# Altium project hava_kalitesi_olcumu.PrjPcb
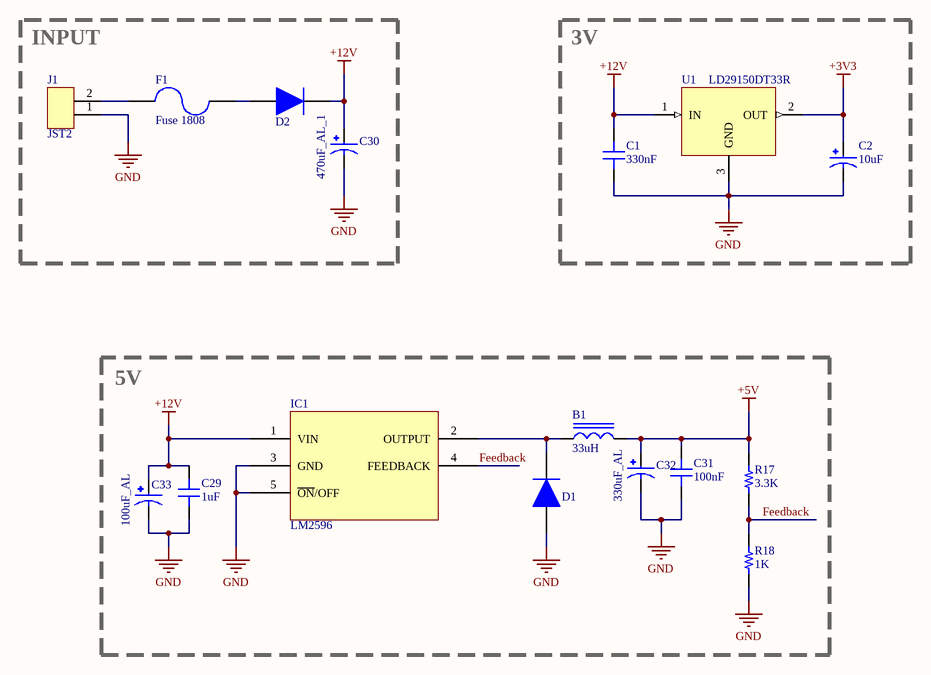
[diagram p0: Power.SchDoc]
4 sheets, 82 parts. Net scope: global (net labels, ports and power ports of the same name join across sheets).
Board file: hava_kalitesi_olcumu.PcbDoc
Sheets:
  Power.SchDoc
  Microcontroller.SchDoc
  GasSensor.SchDoc
  GSM.SchDoc

## Sheet Power.SchDoc
size A4

### Parts
B1  33uH  [DR125]
C1  330nF  [CAP 0603_1608]
C2  10uF  [TANTAL B-CASE]
C29  1uF  [CAP 0603_1608]
C30  470uF_AL_1  [10x12 Al Cap]
C31  100nF  [CAP 0603_1608]
C32  330uF_AL  [10x12 Al Cap]
C33  100uF_AL  [10x12 Al Cap]
D1  1N4148WS  [SOD323F]  (value not drawn)
D2  1N4148WS  [SOD323F]  (value not drawn)
F1  Fuse 1808  [1808]
IC1  LM2596  [D2PAK]
J1  JST2  [JST2]
R17  3.3K  [RES 0603_1608]
R18  1K  [RES 0603_1608]
U1  LD29150DT33R  [TO252-3 DPAK]

### Blocks framed on the sheet
INPUT: C30 D2 F1 J1
3V: C1 C2 U1
5V: B1 C29 C31-C33 D1 IC1 R17 R18

### Nets
+3V3: C2.+ U1.2(OUT)
+5V: B1.2 C31.2 C32.1(+) R17.2
+12V: C1.2 C29.2 C30.1(+) C33.1(+) D2.1 IC1.1(VIN) U1.1(IN)
GND: C1.1 C2.- C29.1 C30.2(-) C31.1 C32.2(-) C33.2(-) D1.2 IC1.3(GND) IC1.5(~{ON}/OFF) J1.1 R18.1 U1.3(GND)
Feedback: IC1.4(FEEDBACK) R17.1 R18.2
NetB1_1: B1.1 D1.1 IC1.2(OUTPUT)
NetD2_2: D2.2 F1.2
NetF1_1: F1.1 J1.2

### Library data of the parts
B1 = 33uH: DR125
C1 = 330nF: CERAMİC 1206 SMD
C2 = 10uF: TANTAL
C29 = 1uF: CERAMİC 1206 SMD
C30 = 470uF_AL_1: Aluminium Electrolytic Capacitors; ComponentLink1Description: Vishay; ComponentLink1URL: https://www.mouser.com.tr/datasheet/2/427/136rvi-1762300.pdf
C31 = 100nF: CERAMİC 1206 SMD
C32 = 330uF_AL: Aluminium Electrolytic Capacitors; ComponentLink1Description: Vİshay; ComponentLink1URL: https://www.mouser.com.tr/datasheet/2/427/136rvi-1762300.pdf
C33 = 100uF_AL: Aluminium Electrolytic Capacitors; ComponentLink1Description: Vishay; ComponentLink1URL: https://www.mouser.com.tr/datasheet/2/427/136rvi-1762300.pdf
D1 D2 = 1N4148WS: Diode, Single, 75 V, 150 mA, 1 V, 4 ns; Manufacturer: ON Semiconductor / Fairchild; Forward Current: 150mA; Reverse Recovery Time: 4ns; Max Repetitive Reverse Voltage (Vrrm): 75V; Power Dissipation: 200mW; Max Reverse Current: 5uA; Forward Voltage: 1V; Max Forward Surge Current (Ifsm): 2A; Supplier 1: Digi-Key; Manufacturer Part Number: 1N4148WS; RoHS: Yes; Category: Rectifier Diodes; Stock 1: 79118; Pricing 1: 1=0,17000, 10=0,12100, 100=0,06530, 500=0,05128, 1000=0,03562 (USD); Mount: Surface Mount; Number of Pins: 2; Contact Plating: Tin,Matte; Weight: 0.0276g; Min Operating Temperature: -55°C; Max Operating Temperature: 150°C; Packaging: Tape and Reel; Package Quantity: 1; Recovery Time: 4ns; Average Rectified Current: 150mA; Element Configuration: Single; Reverse Voltage: 75V; Max Reverse Voltage (DC): 75V; Series: -; Length: 1.8mm; Width: 1.35mm; Height: 1mm; Radiation Hardening: No; REACH SVHC: No SVHC; Lead Free: Lead Free; RoHS Compliant: Yes; ComponentLink1URL: https://datasheet.ciiva.com/25968/1n914bws-25968945.pdf?src-supplier=Avnet+Europe; ComponentLink1Description: https://datasheet.ciiva.com/25968/1n914bws-25968945.pdf?src-supplier=Avnet+Europe; ComponentLink2URL: https://datasheet.ciiva.com/30479/0900766b810e1cd3-30479206.pdf?src-supplier=RSComponents; ComponentLink2Description: https://datasheet.ciiva.com/30479/0900766b810e1cd3-30479206.pdf?src-supplier=RSComponents; ComponentLink3URL: https://datasheet.ciiva.com/910/1n4148ws-910381.pdf?src-supplier=Digi-Key; ComponentLink3Description: https://datasheet.ciiva.com/910/1n4148ws-910381.pdf?src-supplier=Digi-Key; ComponentLink4URL: https://datasheet.ciiva.com/15208/getdatasheetpartid-127819-15208358.pdf?src-supplier=Verical; ComponentLink4Description: https://datasheet.ciiva.com/15208/getdatasheetpartid-127819-15208358.pdf?src-supplier=Verical; ComponentLink5URL: https://datasheet.ciiva.com/8300/1n914bws-8300360.pdf?src-supplier=Avnet; ComponentLink5Description: https://datasheet.ciiva.com/8300/1n914bws-8300360.pdf?src-supplier=Avnet; ComponentLink6URL: https://datasheet.ciiva.com/910/1n4148ws-910380.pdf?src-supplier=Digi-Key; ComponentLink6Description: https://datasheet.ciiva.com/910/1n4148ws-910380.pdf?src-supplier=Digi-Key; ComponentLink7URL: https://datasheet.ciiva.com/910/1n4148ws-910382.pdf?src-supplier=Digi-Key; ComponentLink7Description: https://datasheet.ciiva.com/910/1n4148ws-910382.pdf?src-supplier=Digi-Key; Supplier Part Number 1: 1N4148WSFSCT-ND
F1 = FUSE: FUSE BRD MNT 125VAC/VDC; ComponentLink1Description: Direnc.net; ComponentLink1URL: https://www.direnc.net/1a-smd-sigorta; ComponentLink2Description: Motorobit; ComponentLink2URL: https://www.motorobit.com/urun/1a-1808-kilif-smd-sigorta; ComponentLink3Description: Datasheet; ComponentLink3URL: https://www.littelfuse.com/~/media/electronics/datasheets/fuses/littelfuse_fuse_452_454_datasheet.pdf.pdf; ComponentLink4Description: Step; ComponentLink4URL: https://www.3dcontentcentral.com.tr/secure/download-model.aspx?catalogid=171&id=343808; ComponentLink5Description: Özdisan; ComponentLink5URL: https://www.ozdisan.com/devre-koruyucular/sigorta-bilesenleri/sigortalar/0454001-NR
IC1 = LM2596: Buck Converter
J1 = JST2: 2 PIN 2.54MM
R17 = 3.3K: SMT RES 1206
R18 = 1K: SMT RES 1206
U1 = LD29150: IC-29150 REG LDO 3V3 1.5A DPAK; ComponentLink1Description: Özdisan; ComponentLink1URL: https://ozdisan.com/entegre-devreler-ics/guc-entegreleri/lineer-voltaj-regulatorleri/LD29150DT33R

## Sheet Microcontroller.SchDoc
size A4
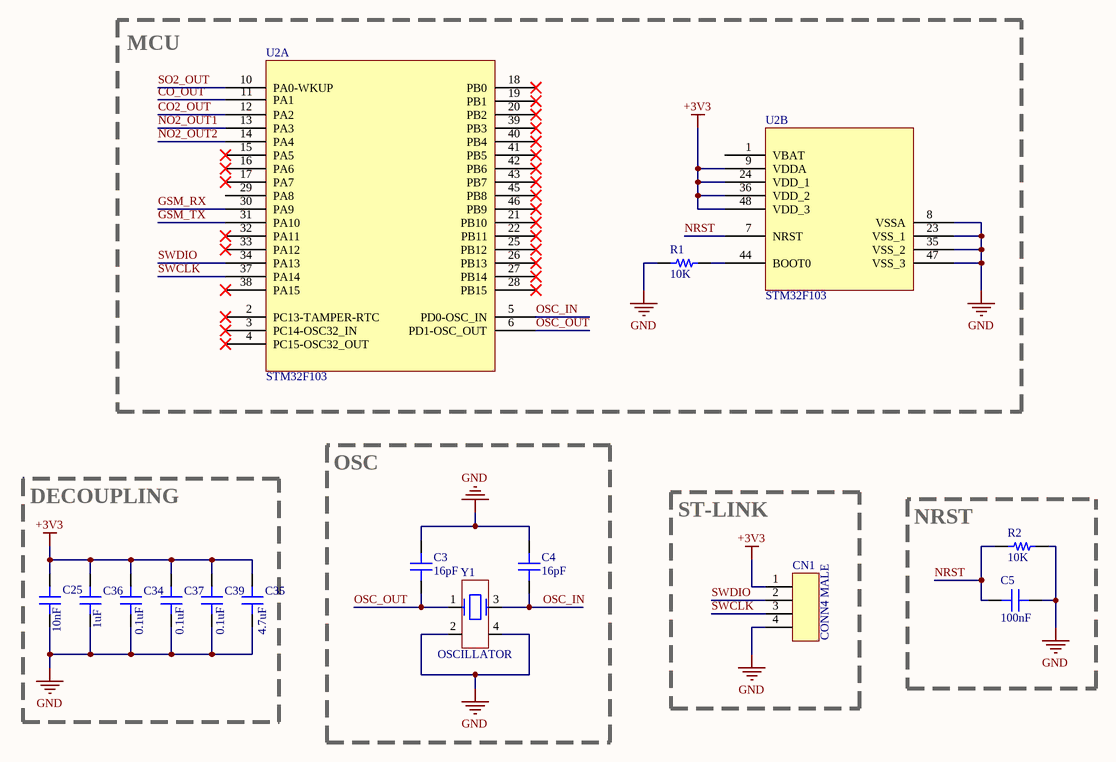
[diagram p1: Microcontroller.SchDoc]

### Parts
C3  16pF  [CAP 0603_1608]
C4  16pF  [CAP 0603_1608]
C5  100nF  [CAP 0603_1608]
C25  10nF  [CAP 0603_1608]
C34  0.1uF  [CAP 0603_1608]
C35  4.7uF  [CAP 0603_1608]
C36  1uF  [CAP 0603_1608]
C37  0.1uF  [CAP 0603_1608]
C39  0.1uF  [CAP 0603_1608]
CN1  CONN4 MALE  [CONN4 MALE]
R1  10K  [RES 0603_1608]
R2  10K  [RES 0603_1608]
U2  STM32F103  [LQFP48]  (parts A,B of 2)
Y1  OSCILLATOR  [OSCILLATOR]

### Blocks framed on the sheet
MCU: R1 U2
DECOUPLING: C25 C34-C37 C39
OSC: C3 C4 Y1
ST-LINK: CN1

### Nets
+3V3: C25.2 C34.2 C35.2 C36.2 C37.2 C39.2 CN1.1 U2.9(VDDA) U2.24(VDD_1) U2.36(VDD_2) U2.48(VDD_3)
GND: C3.2 C4.2 C5.1 C25.1 C34.1 C35.1 C36.1 C37.1 C39.1 CN1.4 R1.1 R2.2 U2.8(VSSA) U2.23(VSS_1) U2.35(VSS_2) U2.47(VSS_3) Y1.2 Y1.4
CO2_OUT: U2.12(PA2)
CO_OUT: U2.11(PA1)
GSM_RX: U2.30(PA9)
GSM_TX: U2.31(PA10)
NO2_OUT1: U2.13(PA3)
NO2_OUT2: U2.14(PA4)
NRST: C5.2 R2.1 U2.7(NRST)
OSC_IN: C4.1 U2.5(PD0-OSC_IN) Y1.3
OSC_OUT: C3.1 U2.6(PD1-OSC_OUT) Y1.1
SO2_OUT: U2.10(PA0-WKUP)
SWCLK: CN1.3 U2.37(PA14)
SWDIO: CN1.2 U2.34(PA13)
NetR1_2: R1.2 U2.44(BOOT0)

Not connected (* = marked no-connect by the designer): U2 1(VBAT) 2(PC13-TAMPER-RTC)* 3(PC14-OSC32_IN)* 4(PC15-OSC32_OUT)* 15(PA5)* 16(PA6)* 17(PA7)* 18(PB0)* 19(PB1)* 20(PB2)* 21(PB10)* 22(PB11)* 25(PB12)* 26(PB13)* 27(PB14)* 28(PB15)* 29(PA8) 32(PA11)* 33(PA12)* 38(PA15)* 39(PB3)* 40(PB4)* 41(PB5)* 42(PB6)* 43(PB7)* 45(PB8)* 46(PB9)*

### Notes on the sheet
- NRST

### Library data of the parts
C3 C4 = 16pF: CERAMİC 1206 SMD
C5 = 100nF: CERAMİC 1206 SMD
C25 = 10nF: CERAMİC 1206 SMD
C34 C37 C39 = 0.1uF: CERAMİC 1206 SMD
C35 = 4.7uF: CERAMİC 1206 SMD
C36 = 1uF: CERAMİC 1206 SMD
CN1 = CONN4 MALE: 4 PIN 2.54MM
R1 R2 = 10K: SMT RES 1206
U2 = STM32F103: STM32F103C8T6 SMD LQFP-48 32-Bit 72 MHz Mikrodenetleyici; ComponentLink1Description: F1Depo; ComponentLink1URL: https://www.f1depo.com/urun/stm32f103c8t6-smd-lqfp-48-32-bit-72-mhz-mikrodenetleyici; ComponentLink2Description: Datasheet; ComponentLink2URL: https://www.st.com/resource/en/datasheet/stm32f103c8.pdf
Y1 = OSCILLATOR: 8MHZ 12.5pF; ComponentLink1Description: Özdisan; ComponentLink1URL: https://ozdisan.com/pasif-komponentler/kristaller-osilatorler-ve-rezanatorler/kristaller/RH100-8-000-12-5-20150-E

## Sheet GasSensor.SchDoc
size A4
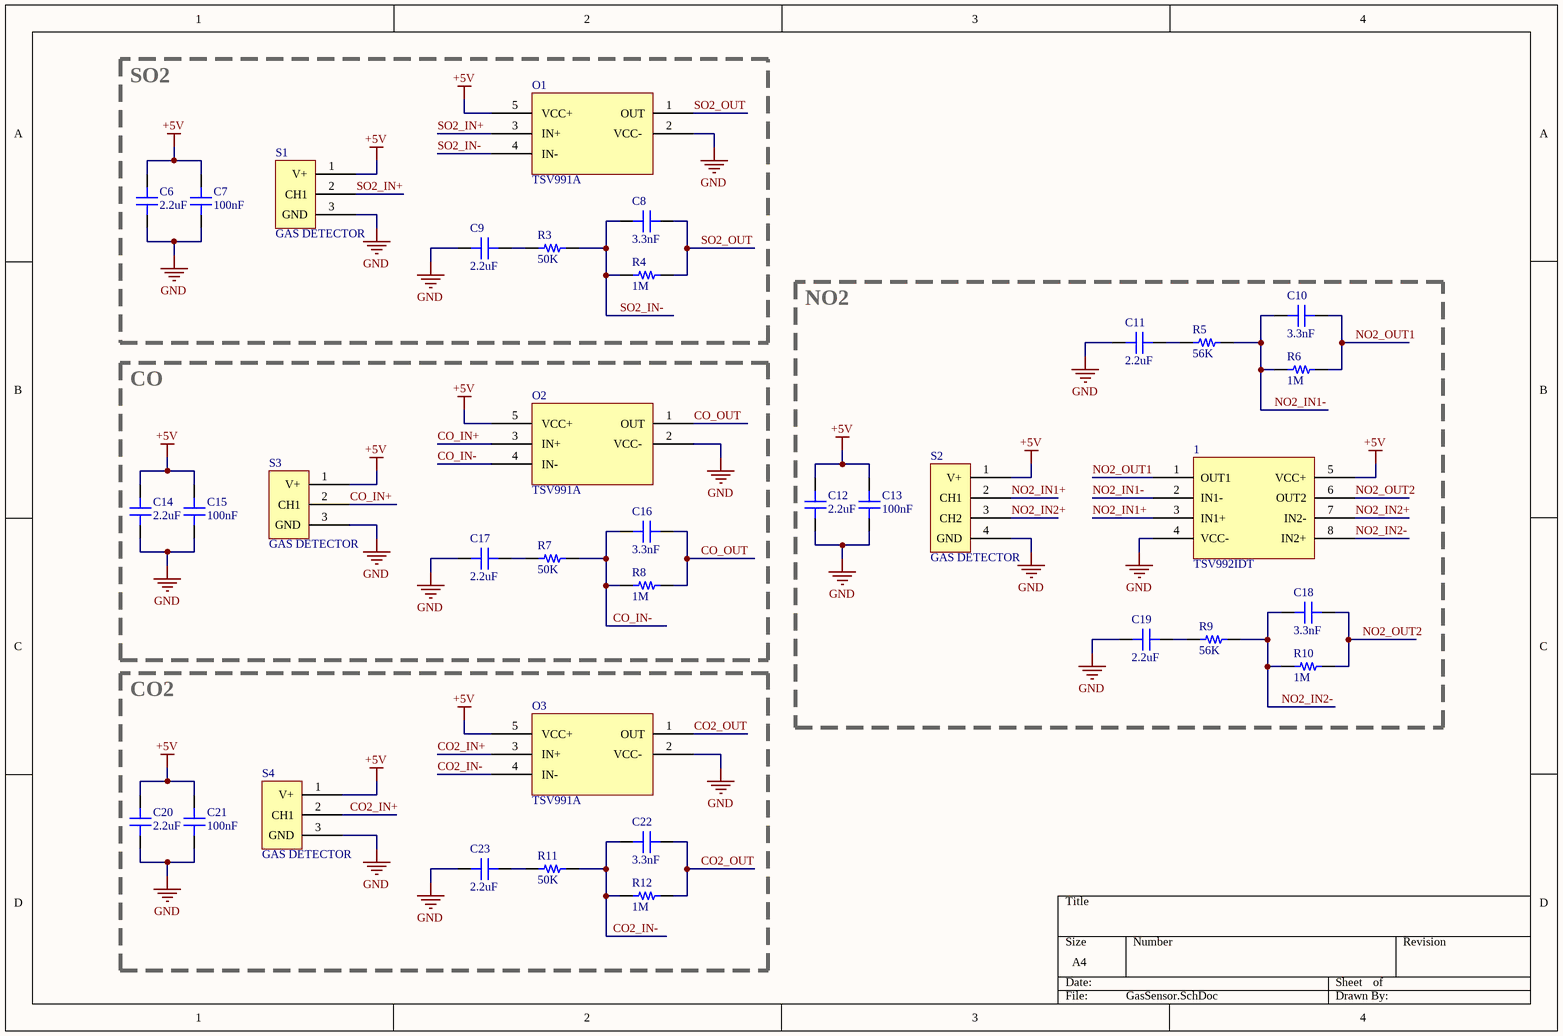
[diagram p2: GasSensor.SchDoc]

### Parts
1  TSV992IDT  [SOIC8]
C6  2.2uF  [CAP 0603_1608]
C7  100nF  [CAP 0603_1608]
C8  3.3nF  [CAP 0603_1608]
C9  2.2uF  [CAP 0603_1608]
C10  3.3nF  [CAP 0603_1608]
C11  2.2uF  [CAP 0603_1608]
C12  2.2uF  [CAP 0603_1608]
C13  100nF  [CAP 0603_1608]
C14  2.2uF  [CAP 0603_1608]
C15  100nF  [CAP 0603_1608]
C16  3.3nF  [CAP 0603_1608]
C17  2.2uF  [CAP 0603_1608]
C18  3.3nF  [CAP 0603_1608]
C19  2.2uF  [CAP 0603_1608]
C20  2.2uF  [CAP 0603_1608]
C21  100nF  [CAP 0603_1608]
C22  3.3nF  [CAP 0603_1608]
C23  2.2uF  [CAP 0603_1608]
O1  TSV991A  [SOT23-5]
O2  TSV991A  [SOT23-5]
O3  TSV991A  [SOT23-5]
R3  50K  [RES 0603_1608]
R4  1M  [RES 0603_1608]
R5  56K  [RES 0603_1608]
R6  1M  [RES 0603_1608]
R7  50K  [RES 0603_1608]
R8  1M  [RES 0603_1608]
R9  56K  [RES 0603_1608]
R10  1M  [RES 0603_1608]
R11  50K  [RES 0603_1608]
R12  1M  [RES 0603_1608]
S1  GAS DETECTOR  [TO-39 CIRCLE]
S2  GAS DETECTOR  [TO-39 DUAL]
S3  GAS DETECTOR  [TO-39 CIRCLE]
S4  GAS DETECTOR  [TO-39 CIRCLE]

### Blocks framed on the sheet
SO2: C6-C9 O1 R3 R4 S1
NO2: 1 C10-C13 C18 C19 R5 R6 R9 R10 S2
CO: C14-C17 O2 R7 R8 S3
CO2: C20-C23 O3 R11 R12 S4

### Nets
+5V: 1.5(VCC+) C6.1 C7.2 C12.1 C13.2 C14.1 C15.2 C20.1 C21.2 O1.5(VCC+) O2.5(VCC+) O3.5(VCC+) S1.1(V+) S2.1(V+) S3.1(V+) S4.1(V+)
GND: 1.4(VCC-) C6.2 C7.1 C9.1 C11.1 C12.2 C13.1 C14.2 C15.1 C17.1 C19.1 C20.2 C21.1 C23.1 O1.2(VCC-) O2.2(VCC-) O3.2(VCC-) S1.3(GND) S2.4(GND) S3.3(GND) S4.3(GND)
CO2_IN+: O3.3(IN+) S4.2(CH1)
CO2_IN-: C22.1 O3.4(IN-) R11.2 R12.1
CO2_OUT: C22.2 O3.1(OUT) R12.2
CO_IN+: O2.3(IN+) S3.2(CH1)
CO_IN-: C16.1 O2.4(IN-) R7.2 R8.1
CO_OUT: C16.2 O2.1(OUT) R8.2
NO2_IN1+: 1.3(IN1+) S2.2(CH1)
NO2_IN1-: 1.2(IN1-) C10.1 R5.2 R6.1
NO2_IN2+: 1.7(IN2-) S2.3(CH2)
NO2_IN2-: 1.8(IN2+) C18.1 R9.2 R10.1
NO2_OUT1: 1.1(OUT1) C10.2 R6.2
NO2_OUT2: 1.6(OUT2) C18.2 R10.2
SO2_IN+: O1.3(IN+) S1.2(CH1)
SO2_IN-: C8.1 O1.4(IN-) R3.2 R4.1
SO2_OUT: C8.2 O1.1(OUT) R4.2
NetC9_2: C9.2 R3.1
NetC11_2: C11.2 R5.1
NetC17_2: C17.2 R7.1
NetC19_2: C19.2 R9.1
NetC23_2: C23.2 R11.1

### Library data of the parts
1 = TSV992IDT: Operational Amplifiers Op Amps SOIC-8 2 Channel 20 MHz; ComponentLink1Description: Digi-Key; ComponentLink1URL: https://www.digikey.com/en/products/detail/stmicroelectronics/TSV992IDT/1578406
C6 C9 C11 C12 C14 C17 C19 C20 C23 = 2.2uF: CERAMİC 1206 SMD
C7 C13 C15 C21 = 100nF: CERAMİC 1206 SMD
C8 C10 C16 C18 C22 = 3.3nF: CERAMİC 1206 SMD
O1-O3 = TSV991A: Operational Amplifiers Op Amps SOT23-5 1 Channel 20 MHz; ComponentLink1Description: Mouser; ComponentLink1URL: https://www.mouser.com.tr/ProductDetail/STMicroelectronics/TSV991AILT?qs=NCG0bTVqH4ejiP6AM1B8jw%3D%3D
R3 R7 R11 = 50K: SMT RES 1206
R4 R6 R8 R10 R12 = 1M: SMT RES 1206
R5 R9 = 56K: SMT RES 1206
S1 S3 S4 = QGC Circle Sensor: GAS DETECTOR, ANALOG TO-39, GAS
S2 = QGC Dual Sensor: GAS DETECTOR, ANALOG TO-39, GAS

## Sheet GSM.SchDoc
size A4
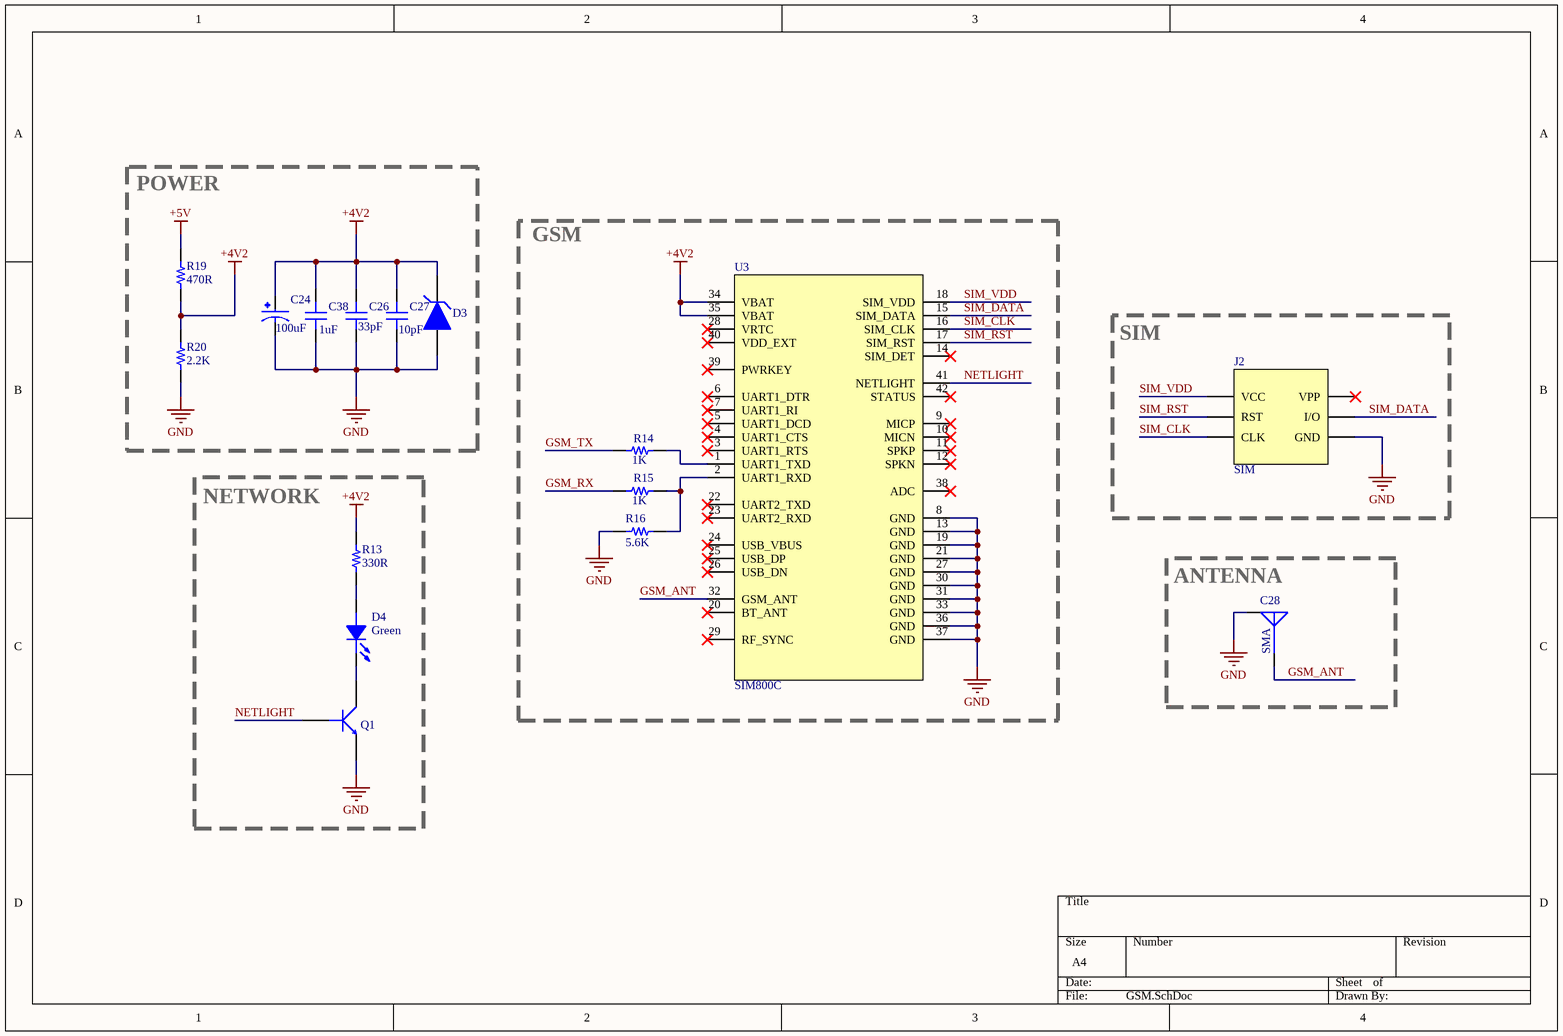
[diagram p3: GSM.SchDoc]

### Parts
C24  100uF  [TANTAL B-CASE]
C26  33pF  [CAP 0603_1608]
C27  10pF  [CAP 0603_1608]
C28  SMA  [132134-11 SMA ANTEN]
C38  1uF  [CAP 0603_1608]
D3  ZENER DIODE  [SOD123]  (value not drawn)
D4  value Green  [0805 Green LED]  (hidden comment: 0805 Green LED)
J2  SIM  [GCT_SIM7100-6-1-15-00-A_REVC]
Q1  MMBT3904-7-F  [SOT-23F]  (value not drawn)
R13  330R  [RES 0603_1608]
R14  1K  [RES 0603_1608]
R15  1K  [RES 0603_1608]
R16  5.6K  [RES 0603_1608]
R19  470R  [RES 0603_1608]
R20  2.2K  [RES 0603_1608]
U3  SIM800C  [LCC110P1570X1760X250-42N]

### Blocks framed on the sheet
POWER: C24 C26 C27 C38 D3 R19 R20
GSM: R14-R16 U3
SIM: J2
NETWORK: D4 Q1 R13
ANTENNA: C28

### Nets
+4V2: C24.+ C26.2 C27.2 C38.2 D3.C R13.2 R19.1 R20.2 U3.34(VBAT) U3.35(VBAT)
+5V: R19.2
GND: C24.- C26.1 C27.1 C28.G C38.1 D3.A J2.C5(GND) Q1.2(E) R16.1 R20.1 U3.8(GND) U3.13(GND) U3.19(GND) U3.21(GND) U3.27(GND) U3.30(GND) U3.31(GND) U3.33(GND) U3.36(GND) U3.37(GND)
GSM_ANT: C28.S U3.32(GSM_ANT)
GSM_RX: R15.1
GSM_TX: R14.1
NETLIGHT: Q1.1(B) U3.41(NETLIGHT)
SIM_CLK: J2.C3(CLK) U3.16(SIM_CLK)
SIM_DATA: J2.C7(I/O) U3.15(SIM_DATA)
SIM_RST: J2.C2(RST) U3.17(SIM_RST)
SIM_VDD: J2.C1(VCC) U3.18(SIM_VDD)
NetD4_1: D4.1(ANODE) R13.1
NetD4_2: D4.2(CATHODE) Q1.3(C)
NetR14_2: R14.2 U3.1(UART1_TXD)
NetR15_2: R15.2 R16.2 U3.2(UART1_RXD)

Not connected (* = marked no-connect by the designer): J2 C6(VPP)*; U3 3(UART1_RTS)* 4(UART1_CTS)* 5(UART1_DCD)* 6(UART1_DTR)* 7(UART1_RI)* 9(MICP)* 10(MICN)* 11(SPKP)* 12(SPKN)* 14(SIM_DET)* 20(BT_ANT)* 22(UART2_TXD)* 23(UART2_RXD)* 24(USB_VBUS)* 25(USB_DP)* 26(USB_DN)* 28(VRTC)* 29(RF_SYNC)* 38(ADC)* 39(PWRKEY)* 40(VDD_EXT)* 42(STATUS)*

### Library data of the parts
C24 = 100uF: TANTAL
C26 = 33pF: CERAMİC 1206 SMD
C27 = 10pF: CERAMİC 1206 SMD
C28 = Anten SMA  2: SMA Anten Connector; ComponentLink1Description: Özdisan; ComponentLink1URL: https://www.ozdisan.com/konnektor-ve-baglanti-elemanlari/koaksiyel-konnektorler/sma-konnektorler/CONSMA002-G
C38 = 1uF: CERAMİC 1206 SMD
D3 = ZENER DIODE: SOD123; Manufacturer: ON Semiconductor; Manufacturer Part Number: 1SMB5919BT3G; Material: Plastic; Max Power Dissipation: 3W; Tolerance: 5%; Max Reverse Leakage Current: 5uA; Impedance: 2R; Zener Voltage: 5.6V; Element Configuration: Single; Forward Voltage: 1.5V; Power Dissipation: 550mW; Zener Current: 267mA; Test Current: 66.9mA; Breakdown Voltage: 5.88V; ESD Protection: Yes; Supplier 1: Digi-Key; RoHS: Yes; Category: Zener Diodes; Pricing 1: 1=0,45000, 10=0,31900, 100=0,16110, 500=0,14274, 1000=0,11109 (USD); Case/Package: SMB; Number of Pins: 2; Contact Plating: Tin,Matte; Min Operating Temperature: -65°C; Max Operating Temperature: 150°C; Package Quantity: 1; Packaging: Tape and Reel; Voltage Tolerance: 5%; Voltage Rating (DC): 5.6V; Power Rating: 3W; Length: 4.32mm; Width: 3.56mm; Height: 2.13mm; Radiation Hardening: No; Lead Free: Lead Free; Halogen Free: Halogen Free; REACH SVHC: No SVHC; ComponentLink2URL: https://datasheet.ciiva.com/1182/1smb5913bt3-d-1182657.pdf?src-supplier=Element14; ComponentLink2Description: https://datasheet.ciiva.com/1182/1smb5913bt3-d-1182657.pdf?src-supplier=Element14; ComponentLink3URL: https://datasheet.ciiva.com/1182/1smb5913bt3-d-1182658.pdf?src-supplier=Element14; ComponentLink3Description: https://datasheet.ciiva.com/1182/1smb5913bt3-d-1182658.pdf?src-supplier=Element14; ComponentLink4URL: https://datasheet.ciiva.com/895/1smb5913bt3-d-895203.pdf?src-supplier=Digi-Key; ComponentLink4Description: https://datasheet.ciiva.com/895/1smb5913bt3-d-895203.pdf?src-supplier=Digi-Key; ComponentLink5URL: https://datasheet.ciiva.com/895/1smb5913bt3-d-895204.pdf?src-supplier=Digi-Key; ComponentLink5Description: https://datasheet.ciiva.com/895/1smb5913bt3-d-895204.pdf?src-supplier=Digi-Key; ComponentLink6URL: https://datasheet.ciiva.com/895/1smb5913bt3-d-895205.pdf?src-supplier=Digi-Key; ComponentLink6Description: https://datasheet.ciiva.com/895/1smb5913bt3-d-895205.pdf?src-supplier=Digi-Key; ComponentLink7URL: https://datasheet.ciiva.com/15198/getdatasheetpartid-311040-15198695.pdf?src-supplier=Verical; ComponentLink7Description: https://datasheet.ciiva.com/15198/getdatasheetpartid-311040-15198695.pdf?src-supplier=Verical; ComponentLink8URL: https://datasheet.ciiva.com/16311/1smb5913bt3-d-16311847.pdf?src-supplier=Future+Electronics; ComponentLink8Description: https://datasheet.ciiva.com/16311/1smb5913bt3-d-16311847.pdf?src-supplier=Future+Electronics; ComponentLink9URL: https://datasheet.ciiva.com/16472/1smb5913bt3-d-16472779.pdf?src-supplier=Avnet+Asia; ComponentLink9Description: https://datasheet.ciiva.com/16472/1smb5913bt3-d-16472779.pdf?src-supplier=Avnet+Asia; Max Reverse Current: 5uA; Supplier Part Number 1: 1SMB5919BT3GOSCT-ND
D4 = 0805 Green LED: Manufacturer: AVAGO Technologies; Manufacturer Code: HSMG-C170; Current: 20mA; Voltage: 2.2V; Farnell Code: 5790852; Unit Price: 0,134 €
J2 = SIM7100-6-1-15-00-A: Memory Card Connectors Micro SIM Card Connector - Push-Push Type, 6 Pin, SMT, 1.50mm Profile; MF: Global Connector Technology; Package: None; Availability: Unavailable; SnapEDA_Link: https://www.snapeda.com/parts/SIM7100-6-1-15-00-A/Global%20Connector%20Technology/view-part/449163/?ref=snap; MP: SIM7100-6-1-15-00-A; Price: None; Value: *; ComponentLink1Description: Özdisan; ComponentLink1URL: https://ozdisan.com/konnektor-ve-baglanti-elemanlari/hafiza-konnektorleri/pc-kart-soketleri/L-KLS1-SIM-064-62P-H1
Q1 = MMBT3904-7-F: Transistor General Purpose BJT NPN 40 Volt 0.2A Automotive 3-Pin SOT-23; Manufacturer: Diodes Zetex; Designed by: BERK; Max Power Dissipation: 300mW; Collector Emitter Voltage (VCEO): 40V; Max Collector Current: 200mA; Collector Base Voltage (VCBO): 60V; Frequency: 300MHz; hFE Min: 100; Number of Elements: 1; Emitter Base Voltage (VEBO): 6V; Collector Emitter Saturation Voltage: 300mV; Power Dissipation: 350mW; Element Configuration: Single; Supplier 1: Digi-Key; Manufacturer Part Number: MMBT3904-7-F; RoHS: Yes; Category: BJTs; Stock 1: 2393281; Pricing 1: 1=0,12000, 10=0,08600, 25=0,08280, 100=0,04660, 500=0,03664, 1000=0,02544 (USD); Mount: Surface Mount; Case/Package: SOT-23; Number of Pins: 3; Weight: 0.000282oz; Contact Plating: Tin,Matte; Min Operating Temperature: -55°C; Max Operating Temperature: 150°C; Polarity: NPN; Packaging: Tape and Reel; Package Quantity: 3000; Transition Frequency: 300MHz; Collector Emitter Breakdown Voltage: 40V; Max Breakdown Voltage: 40V; Continuous Collector Current: 200mA; Max Frequency: 300MHz; Gain Bandwidth Product: 300MHz; Series: -; Collector-emitter Voltage-Max: 300mV; Voltage Rating (DC): 40V; Length: 3.05mm; Width: 1.4mm; Height: 1mm; Radiation Hardening: No; REACH SVHC: No SVHC; Lead Free: Lead Free; RoHS Compliant: Yes; ComponentLink1URL: https://datasheet.ciiva.com/11201/ds30036-11201778.pdf?src-supplier=Avnet; ComponentLink1Description: https://datasheet.ciiva.com/11201/ds30036-11201778.pdf?src-supplier=Avnet; ComponentLink2URL: https://datasheet.ciiva.com/15138/getdatasheetpartid-53265-15138780.pdf?src-supplier=Verical; ComponentLink2Description: https://datasheet.ciiva.com/15138/getdatasheetpartid-53265-15138780.pdf?src-supplier=Verical; ComponentLink3URL: https://datasheet.ciiva.com/6361/ds30036-6361254.pdf?src-supplier=Digi-Key; ComponentLink3Description: https://datasheet.ciiva.com/6361/ds30036-6361254.pdf?src-supplier=Digi-Key; ComponentLink4URL: https://datasheet.ciiva.com/22711/1915516-22711750.pdf?src-supplier=Element14; ComponentLink4Description: https://datasheet.ciiva.com/22711/1915516-22711750.pdf?src-supplier=Element14; ComponentLink5URL: https://datasheet.ciiva.com/11198/ds30036-11198999.pdf?src-supplier=Avnet; ComponentLink5Description: https://datasheet.ciiva.com/11198/ds30036-11198999.pdf?src-supplier=Avnet; ComponentLink6URL: https://datasheet.ciiva.com/6361/ds30036-6361256.pdf?src-supplier=Digi-Key; ComponentLink6Description: https://datasheet.ciiva.com/6361/ds30036-6361256.pdf?src-supplier=Digi-Key; Supplier Part Number 1: MMBT3904-FDIDKR-ND
R13 = 330R: SMT RES 1206
R14 R15 = 1K: SMT RES 1206
R16 = 5.6K: SMT RES 1206
R19 = 470R: SMT RES 1206
R20 = 2.2K: SMT RES 1206
U3 = SIM800C: GSM/Bluetooth; Value: *; Price: None; Package: None; MP: SIM800C; ComponentLink1Description: Robolink; ComponentLink1URL: https://www.robolinkmarket.com/sim800c-gsm-gprs-modulu

## Nets that join several sheets
+3V3: Power (C2.+ U1.2), Microcontroller (11 pins)
+5V: Power (B1.2 C31.2 C32.1 R17.2), GasSensor (16 pins), GSM (R19.2)
GND: Power (13 pins), Microcontroller (18 pins), GasSensor (21 pins), GSM (20 pins)
CO2_OUT: Microcontroller (U2.12), GasSensor (C22.2 O3.1 R12.2)
CO_OUT: Microcontroller (U2.11), GasSensor (C16.2 O2.1 R8.2)
GSM_RX: Microcontroller (U2.30), GSM (R15.1)
GSM_TX: Microcontroller (U2.31), GSM (R14.1)
NO2_OUT1: Microcontroller (U2.13), GasSensor (1.1 C10.2 R6.2)
NO2_OUT2: Microcontroller (U2.14), GasSensor (1.6 C18.2 R10.2)
SO2_OUT: Microcontroller (U2.10), GasSensor (C8.2 O1.1 R4.2)